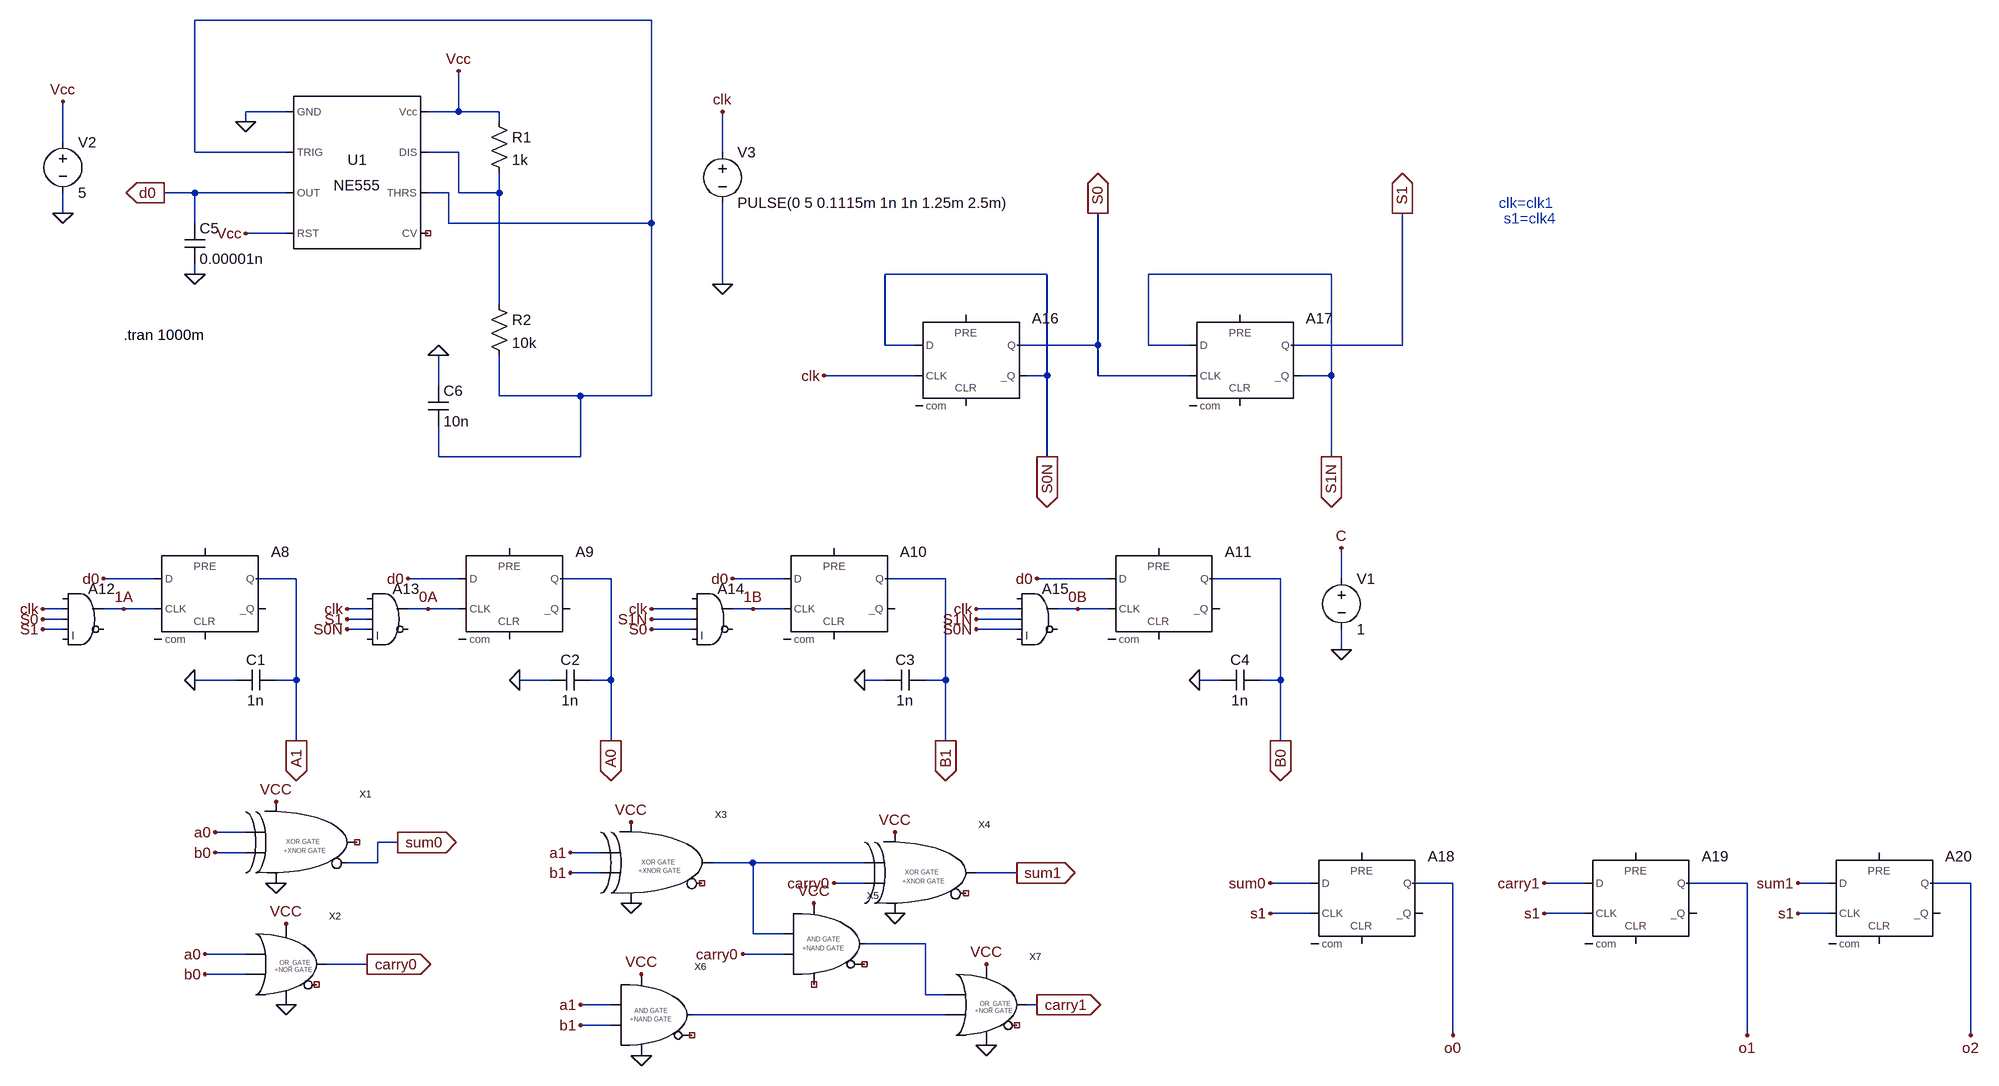
[diagram p0: schematic FAILURE.asc]
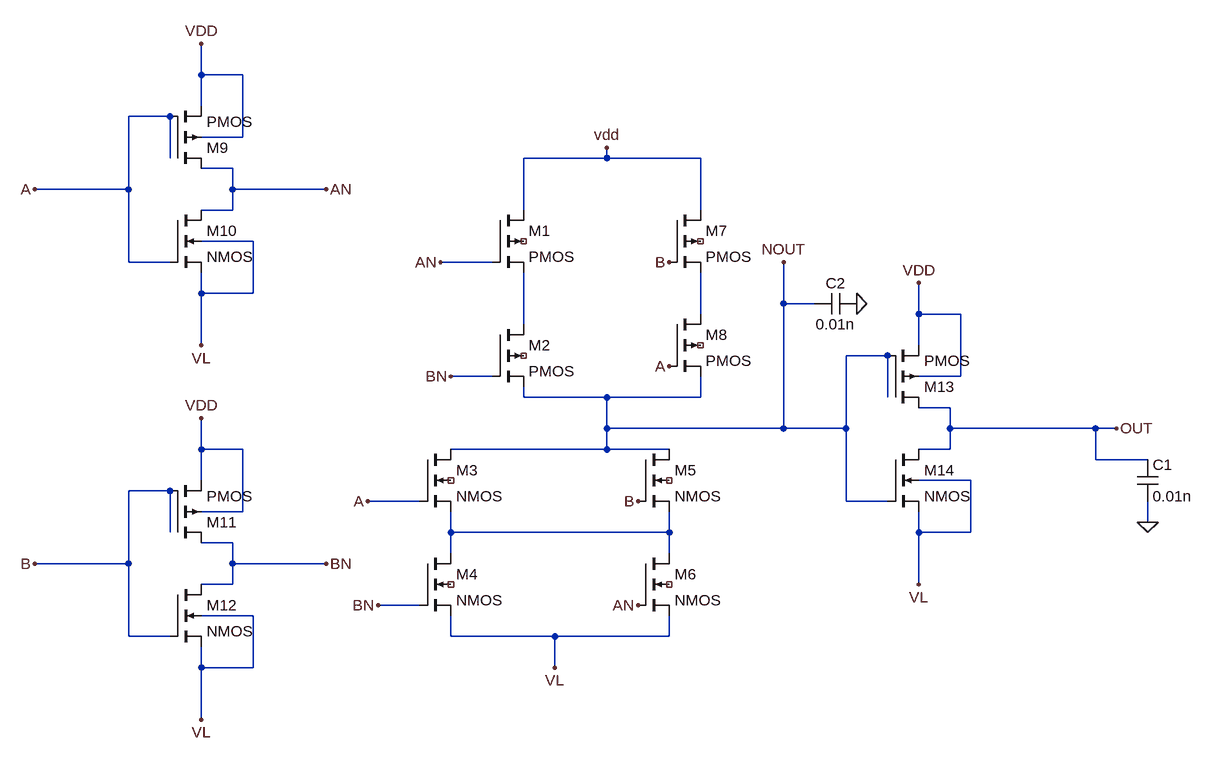
[diagram p1: sub-circuit xor_gate.asc]
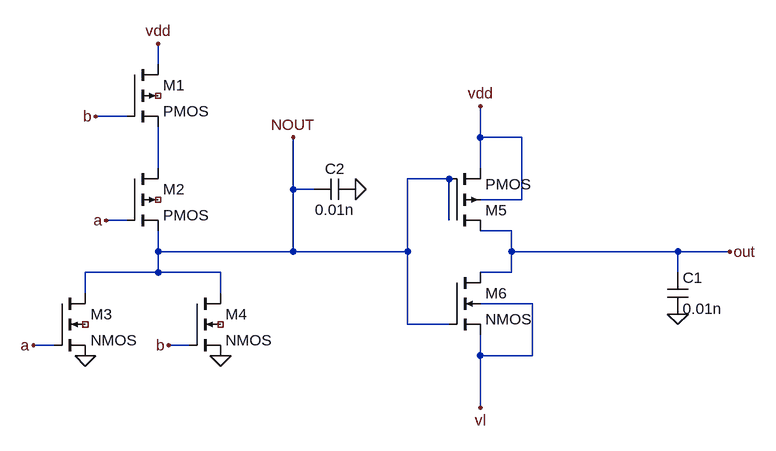
[diagram p2: sub-circuit or_gate1.asc]
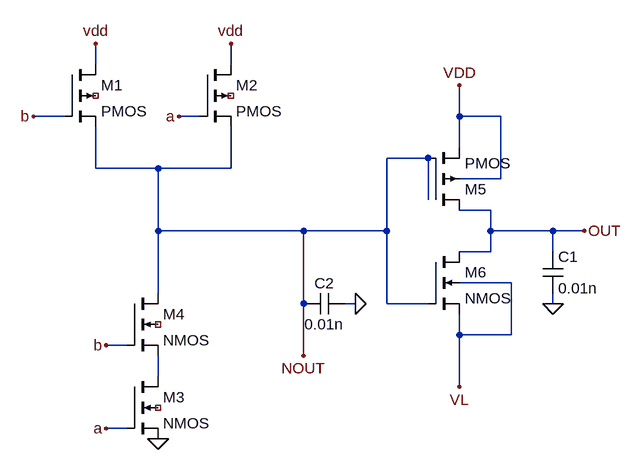
[diagram p3: sub-circuit and_gate1.asc]
FAILURE.asc, the LTspice schematic file:
Version 4
SHEET 1 1872 1100
WIRE -240 -720 -960 -720
WIRE -816 -576 -880 -576
WIRE -544 -576 -544 -640
WIRE -544 -576 -592 -576
WIRE -480 -576 -544 -576
WIRE -880 -560 -880 -576
WIRE -480 -560 -480 -576
WIRE -1168 -528 -1168 -592
WIRE -960 -512 -960 -720
WIRE -816 -512 -960 -512
WIRE -544 -512 -592 -512
WIRE -128 -512 -128 -576
WIRE -960 -448 -1008 -448
WIRE -816 -448 -960 -448
WIRE -560 -448 -592 -448
WIRE -544 -448 -544 -512
WIRE -480 -448 -480 -480
WIRE -480 -448 -544 -448
WIRE -1168 -416 -1168 -448
WIRE -960 -400 -960 -448
WIRE -560 -400 -560 -448
WIRE -240 -400 -240 -720
WIRE -240 -400 -560 -400
WIRE -816 -384 -880 -384
WIRE -960 -320 -960 -336
WIRE 384 -320 128 -320
WIRE 832 -320 544 -320
WIRE -128 -304 -128 -432
WIRE -480 -272 -480 -448
WIRE 128 -208 128 -320
WIRE 176 -208 128 -208
WIRE 464 -208 464 -416
WIRE 464 -208 336 -208
WIRE 544 -208 544 -320
WIRE 608 -208 544 -208
WIRE 944 -208 944 -416
WIRE 944 -208 768 -208
WIRE 176 -160 32 -160
WIRE 384 -160 384 -320
WIRE 384 -160 352 -160
WIRE 464 -160 464 -208
WIRE 608 -160 464 -160
WIRE 832 -160 832 -320
WIRE 832 -160 784 -160
WIRE -576 -144 -576 -192
WIRE -480 -128 -480 -192
WIRE -352 -128 -480 -128
WIRE -240 -128 -240 -400
WIRE -240 -128 -352 -128
WIRE -576 -32 -576 -80
WIRE -352 -32 -352 -128
WIRE -352 -32 -576 -32
WIRE 384 -32 384 -160
WIRE 832 -32 832 -160
WIRE -1024 160 -1104 160
WIRE -800 160 -864 160
WIRE -544 160 -624 160
WIRE -304 160 -384 160
WIRE -32 160 -112 160
WIRE 224 160 128 160
WIRE 480 160 368 160
WIRE 752 160 640 160
WIRE 848 160 848 112
WIRE -1168 208 -1200 208
WIRE -1072 208 -1104 208
WIRE -1024 208 -1072 208
WIRE -688 208 -720 208
WIRE -592 208 -624 208
WIRE -544 208 -592 208
WIRE -176 208 -240 208
WIRE -80 208 -112 208
WIRE -32 208 -80 208
WIRE 336 208 272 208
WIRE 432 208 400 208
WIRE 480 208 432 208
WIRE -1168 224 -1200 224
WIRE -688 224 -720 224
WIRE -176 224 -240 224
WIRE 336 224 272 224
WIRE -1168 240 -1200 240
WIRE -688 240 -720 240
WIRE -176 240 -240 240
WIRE 336 240 272 240
WIRE 848 272 848 240
WIRE -896 320 -960 320
WIRE -800 320 -800 160
WIRE -800 320 -832 320
WIRE -400 320 -448 320
WIRE -304 320 -304 160
WIRE -304 320 -336 320
WIRE 128 320 96 320
WIRE 224 320 224 160
WIRE 224 320 192 320
WIRE 656 320 624 320
WIRE 752 320 752 160
WIRE 752 320 720 320
WIRE -800 416 -800 320
WIRE -304 416 -304 320
WIRE 224 416 224 320
WIRE 752 416 752 320
WIRE -880 560 -928 560
WIRE -640 576 -672 576
WIRE -880 592 -928 592
WIRE -320 592 -368 592
WIRE -672 608 -672 576
WIRE -672 608 -720 608
WIRE -80 608 -144 608
WIRE 96 608 -80 608
WIRE -320 624 -368 624
WIRE 336 624 272 624
WIRE 96 640 48 640
WIRE 800 640 736 640
WIRE 1024 640 960 640
WIRE 1232 640 1168 640
WIRE 1488 640 1392 640
WIRE 1616 640 1568 640
WIRE 1840 640 1776 640
WIRE 800 688 736 688
WIRE 1232 688 1168 688
WIRE 1616 688 1568 688
WIRE -80 720 -80 608
WIRE -32 720 -80 720
WIRE 192 736 96 736
WIRE -880 752 -944 752
WIRE -32 752 -96 752
WIRE -688 768 -752 768
WIRE -880 784 -944 784
WIRE 192 816 192 736
WIRE 224 816 192 816
WIRE -304 832 -352 832
WIRE 368 832 352 832
WIRE 224 848 -176 848
WIRE -304 864 -352 864
WIRE 1024 880 1024 640
WIRE 1488 880 1488 640
WIRE 1840 880 1840 640
FLAG -368 592 a1
FLAG -368 624 b1
FLAG 48 640 carry0
FLAG 336 624 sum1
IOPIN 336 624 Out
FLAG -352 832 a1
FLAG -352 864 b1
FLAG -96 752 carry0
FLAG 368 832 carry1
IOPIN 368 832 Out
FLAG -928 560 a0
FLAG -928 592 b0
FLAG -944 752 a0
FLAG -944 784 b0
FLAG -688 768 carry0
IOPIN -688 768 Out
FLAG -640 576 sum0
IOPIN -640 576 Out
FLAG -1104 160 d0
FLAG -624 160 d0
FLAG -112 160 d0
FLAG 368 160 d0
FLAG -1200 208 clk
FLAG -720 208 clk
FLAG -240 208 clk
FLAG 272 208 clk
FLAG -1200 224 S0
FLAG -1200 240 S1
FLAG -720 224 S1
FLAG -240 240 S0
FLAG -800 416 A1
IOPIN -800 416 Out
FLAG 752 416 B0
IOPIN 752 416 Out
FLAG -720 240 S0N
FLAG -240 224 S1N
FLAG 272 224 S1N
FLAG 272 240 S0N
FLAG -304 416 A0
IOPIN -304 416 Out
FLAG 224 416 B1
IOPIN 224 416 Out
FLAG -960 320 0
FLAG -448 320 0
FLAG 96 320 0
FLAG 624 320 0
FLAG -1072 208 1A
FLAG -592 208 0A
FLAG -80 208 1B
FLAG 432 208 0B
FLAG 848 112 C
FLAG 848 272 0
FLAG 32 -160 clk
FLAG 464 -416 S0
IOPIN 464 -416 Out
FLAG 384 -32 S0N
IOPIN 384 -32 Out
FLAG 944 -416 S1
IOPIN 944 -416 Out
FLAG 832 -32 S1N
IOPIN 832 -32 Out
FLAG -880 -560 0
FLAG -544 -640 Vcc
FLAG -880 -384 Vcc
FLAG -1168 -592 Vcc
FLAG -1168 -416 0
FLAG -1008 -448 d0
IOPIN -1008 -448 Out
FLAG -960 -320 0
FLAG -128 -304 0
FLAG -128 -576 clk
FLAG -576 -192 0
FLAG 736 640 sum0
FLAG 736 688 s1
FLAG 1024 880 o0
FLAG 1488 880 o1
FLAG 1840 880 o2
FLAG 1568 640 sum1
FLAG 1568 688 s1
FLAG 1168 640 carry1
FLAG 1168 688 s1
FLAG -832 512 VCC
FLAG -816 704 VCC
FLAG -832 640 0
FLAG -816 832 0
FLAG -272 544 VCC
FLAG 144 560 VCC
FLAG 288 768 VCC
FLAG 16 672 VCC
FLAG -256 784 VCC
FLAG -272 672 0
FLAG 144 688 0
FLAG 288 896 0
FLAG -256 912 0
SYMBOL Digital\\dflop -944 112 R0
SYMATTR InstName A8
SYMBOL Digital\\dflop -464 112 R0
SYMATTR InstName A9
SYMBOL Digital\\dflop 48 112 R0
SYMATTR InstName A10
SYMBOL Digital\\dflop 560 112 R0
SYMATTR InstName A11
SYMBOL Digital\\and -1136 160 R0
SYMATTR InstName A12
SYMBOL Digital\\and -656 160 R0
SYMATTR InstName A13
SYMBOL Digital\\and -144 160 R0
SYMATTR InstName A14
SYMBOL Digital\\and 368 160 R0
SYMATTR InstName A15
SYMBOL cap -832 304 R90
WINDOW 0 0 32 VBottom 2
WINDOW 3 32 32 VTop 2
SYMATTR InstName C1
SYMATTR Value 1n
SYMBOL cap -336 304 R90
WINDOW 0 0 32 VBottom 2
WINDOW 3 32 32 VTop 2
SYMATTR InstName C2
SYMATTR Value 1n
SYMBOL cap 192 304 R90
WINDOW 0 0 32 VBottom 2
WINDOW 3 32 32 VTop 2
SYMATTR InstName C3
SYMATTR Value 1n
SYMBOL cap 720 304 R90
WINDOW 0 0 32 VBottom 2
WINDOW 3 32 32 VTop 2
SYMATTR InstName C4
SYMATTR Value 1n
SYMBOL voltage 848 144 R0
WINDOW 123 0 0 Left 0
WINDOW 39 0 0 Left 0
SYMATTR InstName V1
SYMATTR Value 1
SYMBOL Digital\\dflop 256 -256 R0
SYMATTR InstName A16
SYMBOL Digital\\dflop 688 -256 R0
SYMATTR InstName A17
SYMBOL Misc\\NE555 -704 -480 R0
SYMATTR InstName U1
SYMBOL res -496 -576 R0
SYMATTR InstName R1
SYMATTR Value 1k
SYMBOL voltage -1168 -544 R0
WINDOW 123 0 0 Left 0
WINDOW 39 0 0 Left 0
SYMATTR InstName V2
SYMATTR Value 5
SYMBOL cap -976 -400 R0
SYMATTR InstName C5
SYMATTR Value 0.00001n
SYMBOL voltage -128 -528 R0
WINDOW 123 0 0 Left 0
WINDOW 39 0 0 Left 0
SYMATTR InstName V3
SYMATTR Value PULSE(0 5 0.1115m 1n 1n 1.25m 2.5m)
SYMBOL res -496 -288 R0
SYMATTR InstName R2
SYMATTR Value 10k
SYMBOL cap -592 -144 R0
SYMATTR InstName C6
SYMATTR Value 10n
SYMBOL Digital\\dflop 880 592 R0
SYMATTR InstName A18
SYMBOL Digital\\dflop 1312 592 R0
SYMATTR InstName A19
SYMBOL Digital\\dflop 1696 592 R0
SYMATTR InstName A20
SYMBOL XOR_GATE -880 592 R0
SYMATTR InstName X1
SYMBOL or_gate1 -912 800 R0
SYMATTR InstName X2
SYMBOL XOR_GATE -320 624 R0
SYMATTR InstName X3
SYMBOL XOR_GATE 96 640 R0
SYMATTR InstName X4
SYMBOL AND_GATE1 -80 752 R0
SYMATTR InstName X5
SYMBOL AND_GATE1 -352 864 R0
SYMATTR InstName X6
SYMBOL or_gate1 192 864 R0
SYMATTR InstName X7
TEXT 1096 -432 Left 2 ;clk=clk1
TEXT 1104 -408 Left 2 ;s1=clk4
TEXT -1072 -224 Left 2 !.tran 1000m

xor_gate.asc, the sub-circuit schematic file:
Version 4
SHEET 1 1020 680
WIRE -512 -432 -512 -480
WIRE -448 -432 -512 -432
WIRE -512 -384 -512 -432
WIRE -560 -368 -624 -368
WIRE -448 -336 -448 -432
WIRE -448 -336 -512 -336
WIRE -560 -304 -560 -368
WIRE 112 -304 112 -320
WIRE 112 -304 -16 -304
WIRE 256 -304 112 -304
WIRE -464 -288 -512 -288
WIRE -624 -256 -624 -368
WIRE -624 -256 -768 -256
WIRE -464 -256 -464 -288
WIRE -320 -256 -464 -256
WIRE -464 -224 -464 -256
WIRE -464 -224 -512 -224
WIRE -16 -224 -16 -304
WIRE 256 -224 256 -304
WIRE -432 -176 -512 -176
WIRE -624 -144 -624 -256
WIRE -560 -144 -624 -144
WIRE -64 -144 -144 -144
WIRE -512 -96 -512 -128
WIRE -432 -96 -432 -176
WIRE -432 -96 -512 -96
WIRE 384 -80 384 -144
WIRE 432 -80 384 -80
WIRE 256 -64 256 -128
WIRE 592 -64 592 -112
WIRE 656 -64 592 -64
WIRE -16 -48 -16 -128
WIRE -512 -16 -512 -96
WIRE 592 -16 592 -64
WIRE 544 0 480 0
WIRE -64 32 -128 32
WIRE 656 32 656 -64
WIRE 656 32 592 32
WIRE -16 64 -16 48
WIRE 112 64 -16 64
WIRE 256 64 256 32
WIRE 256 64 112 64
WIRE 544 64 544 0
WIRE 640 80 592 80
WIRE 112 112 112 64
WIRE 384 112 384 -80
WIRE 384 112 112 112
WIRE 480 112 480 0
WIRE 480 112 384 112
WIRE 640 112 640 80
WIRE 864 112 640 112
WIRE 896 112 864 112
WIRE -512 144 -512 96
WIRE -448 144 -512 144
WIRE 112 144 112 112
WIRE 112 144 -128 144
WIRE 208 144 112 144
WIRE 640 144 640 112
WIRE 640 144 592 144
WIRE 864 160 864 112
WIRE 944 160 864 160
WIRE -512 192 -512 144
WIRE 672 192 592 192
WIRE -560 208 -624 208
WIRE -176 224 -256 224
WIRE 480 224 480 112
WIRE 544 224 480 224
WIRE -448 240 -448 144
WIRE -448 240 -512 240
WIRE 944 256 944 224
WIRE -560 272 -560 208
WIRE -128 272 -128 240
WIRE 208 272 208 240
WIRE 208 272 -128 272
WIRE 592 272 592 240
WIRE 672 272 672 192
WIRE 672 272 592 272
WIRE -464 288 -512 288
WIRE -128 304 -128 272
WIRE 208 304 208 272
WIRE -624 320 -624 208
WIRE -624 320 -768 320
WIRE -464 320 -464 288
WIRE -320 320 -464 320
WIRE -464 352 -464 320
WIRE -464 352 -512 352
WIRE 592 352 592 272
WIRE -176 384 -240 384
WIRE -432 400 -512 400
WIRE -624 432 -624 320
WIRE -560 432 -624 432
WIRE -128 432 -128 400
WIRE 32 432 -128 432
WIRE 208 432 208 400
WIRE 208 432 32 432
WIRE -512 480 -512 448
WIRE -432 480 -432 400
WIRE -432 480 -512 480
WIRE 32 480 32 432
WIRE -512 560 -512 480
FLAG -144 -144 AN
FLAG 160 224 B
FLAG -256 224 A
FLAG -128 32 BN
FLAG 112 -320 vdd
FLAG 208 -144 B
FLAG 208 16 A
FLAG -240 384 BN
FLAG 896 112 OUT
FLAG 160 384 AN
FLAG 944 256 0
FLAG -320 -256 AN
FLAG -512 -16 VL
FLAG -512 -480 VDD
FLAG -768 -256 A
FLAG -320 320 BN
FLAG -512 560 VL
FLAG -512 96 VDD
FLAG -768 320 B
FLAG 32 480 VL
FLAG 592 352 VL
FLAG 592 -112 VDD
FLAG 384 -144 NOUT
FLAG 496 -80 0
SYMBOL pmos4 -64 -224 R0
SYMATTR InstName M1
SYMBOL pmos4 -64 -48 R0
SYMATTR InstName M2
SYMBOL nmos4 -176 144 R0
SYMATTR InstName M3
SYMBOL nmos4 -176 304 R0
SYMATTR InstName M4
SYMBOL nmos4 160 144 R0
SYMATTR InstName M5
SYMBOL nmos4 160 304 R0
SYMATTR InstName M6
SYMBOL pmos4 208 -224 R0
SYMATTR InstName M7
SYMBOL pmos4 208 -64 R0
SYMATTR InstName M8
SYMBOL cap 928 160 R0
SYMATTR InstName C1
SYMATTR Value 0.01n
SYMBOL pmos4 -560 -288 M180
SYMATTR InstName M9
SYMBOL nmos4 -560 -224 R0
SYMATTR InstName M10
SYMBOL pmos4 -560 288 M180
SYMATTR InstName M11
SYMBOL nmos4 -560 352 R0
SYMATTR InstName M12
SYMBOL pmos4 544 80 M180
SYMATTR InstName M13
SYMBOL nmos4 544 144 R0
SYMATTR InstName M14
SYMBOL cap 496 -96 R90
WINDOW 0 0 32 VBottom 2
WINDOW 3 32 32 VTop 2
SYMATTR InstName C2
SYMATTR Value 0.01n

or_gate1.asc, the sub-circuit schematic file:
Version 4
SHEET 1 880 680
WIRE -144 -176 -144 -208
WIRE -192 -96 -240 -96
WIRE 352 -64 352 -112
WIRE 416 -64 352 -64
WIRE -144 -16 -144 -80
WIRE 352 -16 352 -64
WIRE 304 0 240 0
WIRE 64 16 64 -64
WIRE 96 16 64 16
WIRE 416 32 416 -64
WIRE 416 32 352 32
WIRE -192 64 -224 64
WIRE 304 64 304 0
WIRE 400 80 352 80
WIRE -144 112 -144 80
WIRE 64 112 64 16
WIRE 64 112 -144 112
WIRE 240 112 240 0
WIRE 240 112 64 112
WIRE 400 112 400 80
WIRE 656 112 400 112
WIRE 736 112 656 112
WIRE -144 144 -144 112
WIRE -144 144 -256 144
WIRE -48 144 -144 144
WIRE 400 144 400 112
WIRE 400 144 352 144
WIRE 656 144 656 112
WIRE -256 176 -256 144
WIRE -48 176 -48 144
WIRE 432 192 352 192
WIRE 240 224 240 112
WIRE 304 224 240 224
WIRE -304 256 -336 256
WIRE -96 256 -128 256
WIRE 352 272 352 240
WIRE 432 272 432 192
WIRE 432 272 352 272
WIRE 352 352 352 272
FLAG -144 -208 vdd
FLAG -240 -96 b
FLAG -224 64 a
FLAG 736 112 out
FLAG -128 256 b
FLAG -336 256 a
FLAG -48 272 0
FLAG -256 272 0
FLAG 656 208 0
FLAG 352 -112 vdd
FLAG 352 352 vl
FLAG 64 -64 NOUT
FLAG 160 16 0
SYMBOL pmos4 -192 -176 R0
SYMATTR InstName M1
SYMBOL pmos4 -192 -16 R0
SYMATTR InstName M2
SYMBOL nmos4 -304 176 R0
SYMATTR InstName M3
SYMBOL nmos4 -96 176 R0
SYMATTR InstName M4
SYMBOL cap 640 144 R0
SYMATTR InstName C1
SYMATTR Value 0.01n
SYMBOL pmos4 304 80 M180
SYMATTR InstName M5
SYMBOL nmos4 304 144 R0
SYMATTR InstName M6
SYMBOL cap 96 32 R270
WINDOW 0 32 32 VTop 2
WINDOW 3 0 32 VBottom 2
SYMATTR InstName C2
SYMATTR Value 0.01n

and_gate1.asc, the sub-circuit schematic file:
Version 4
SHEET 1 880 680
WIRE 16 -128 16 -160
WIRE 224 -128 224 -160
WIRE -32 -48 -80 -48
WIRE 176 -48 144 -48
WIRE 576 -48 576 -96
WIRE 640 -48 576 -48
WIRE 576 0 576 -48
WIRE 528 16 464 16
WIRE 16 32 16 -32
WIRE 112 32 16 32
WIRE 224 32 224 -32
WIRE 224 32 112 32
WIRE 640 48 640 -48
WIRE 640 48 576 48
WIRE 528 80 528 16
WIRE 624 96 576 96
WIRE 112 128 112 32
WIRE 336 128 112 128
WIRE 464 128 464 16
WIRE 464 128 336 128
WIRE 624 128 624 96
WIRE 720 128 624 128
WIRE 768 128 720 128
WIRE 624 160 624 128
WIRE 624 160 576 160
WIRE 720 160 720 128
WIRE 656 208 576 208
WIRE 112 224 112 128
WIRE 336 240 336 128
WIRE 416 240 400 240
WIRE 464 240 464 128
WIRE 528 240 464 240
WIRE 720 240 720 224
WIRE 576 288 576 256
WIRE 656 288 656 208
WIRE 656 288 576 288
WIRE 64 304 32 304
WIRE 336 320 336 240
WIRE 112 352 112 320
WIRE 576 368 576 288
WIRE 64 432 32 432
FLAG 16 -160 vdd
FLAG -80 -48 b
FLAG 144 -48 a
FLAG 32 304 b
FLAG 32 432 a
FLAG 112 448 0
FLAG 224 -160 vdd
FLAG 768 128 OUT
FLAG 576 -96 VDD
FLAG 720 240 0
FLAG 416 240 0
FLAG 336 320 NOUT
FLAG 576 368 VL
SYMBOL pmos4 -32 -128 R0
SYMATTR InstName M1
SYMBOL pmos4 176 -128 R0
SYMATTR InstName M2
SYMBOL nmos4 64 352 R0
SYMATTR InstName M3
SYMBOL nmos4 64 224 R0
SYMATTR InstName M4
SYMBOL pmos4 528 96 M180
SYMATTR InstName M5
SYMBOL nmos4 528 160 R0
SYMATTR InstName M6
SYMBOL cap 704 160 R0
SYMATTR InstName C1
SYMATTR Value 0.01n
SYMBOL cap 336 256 R270
WINDOW 0 32 32 VTop 2
WINDOW 3 0 32 VBottom 2
SYMATTR InstName C2
SYMATTR Value 0.01n

The netlist it stands for:
* FAILURE.asc
A8 d0 0 1A 0 0 0 a1 0 DFLOP
A9 d0 0 0A 0 0 0 a0 0 DFLOP
A10 d0 0 1B 0 0 0 b1 0 DFLOP
A11 d0 0 0B 0 0 0 b0 0 DFLOP
A12 0 clk S0 S1 0 0 1A 0 AND
A13 0 clk S1 S0N 0 0 0A 0 AND
A14 0 clk S1N S0 0 0 1B 0 AND
A15 0 clk S1N S0N 0 0 0B 0 AND
C1 a1 0 1n
C2 a0 0 1n
C3 b1 0 1n
C4 b0 0 1n
V1 C 0 1
A16 S0N 0 clk 0 0 S0N S0 0 DFLOP
A17 S1N 0 S0 0 0 S1N S1 0 DFLOP
XU1 0 N001 d0 Vcc NC_01 N001 N002 Vcc NE555  ; pins GND TRIG OUT RST CV THRS DIS Vcc
R1 Vcc N002 1k
V2 Vcc 0 5
C5 d0 0 0.00001n
V3 clk 0 PULSE(0 5 0.1115m 1n 1n 1.25m 2.5m)
R2 N002 N001 10k
C6 0 N001 10n
A18 sum0 0 S1 0 0 0 o0 0 DFLOP
A19 carry1 0 S1 0 0 0 o1 0 DFLOP
A20 sum1 0 S1 0 0 0 o2 0 DFLOP
XX1 a0 b0 Vcc 0 NC_02 sum0 xor_gate
XX2 a0 b0 Vcc 0 carry0 NC_03 or_gate1
XX3 a1 b1 Vcc 0 N003 NC_04 xor_gate
XX4 N003 carry0 Vcc 0 sum1 NC_05 xor_gate
XX5 N003 carry0 Vcc NC_06 N004 NC_07 and_gate1
XX6 a1 b1 Vcc 0 N005 NC_08 and_gate1
XX7 N004 N005 Vcc 0 carry1 NC_09 or_gate1

* block symbol definitions
.subckt xor_gate A B VDD VL OUT NOUT
M1 vdd AN N002 NC_01 PMOS
M2 N002 BN NOUT NC_02 PMOS
M3 NOUT A N003 NC_03 NMOS
M4 N003 BN VL NC_04 NMOS
M5 NOUT B N003 NC_05 NMOS
M6 N003 AN VL NC_06 NMOS
M7 vdd B N001 NC_07 PMOS
M8 N001 A NOUT NC_08 PMOS
C1 OUT 0 0.01n
M9 AN A vdd vdd PMOS
M10 AN A VL VL NMOS
M11 BN B vdd vdd PMOS
M12 BN B VL VL NMOS
M13 OUT NOUT vdd vdd PMOS
M14 OUT NOUT VL VL NMOS
C2 0 NOUT 0.01n
.ends xor_gate

.subckt or_gate1 a b vdd vl out NOUT
M1 vdd b N001 NC_01 PMOS
M2 N001 a NOUT NC_02 PMOS
M3 NOUT a 0 NC_03 NMOS
M4 NOUT b 0 NC_04 NMOS
C1 out 0 0.01n
M5 out NOUT vdd vdd PMOS
M6 out NOUT vl vl NMOS
C2 NOUT 0 0.01n
.ends or_gate1

.subckt and_gate1 A B VDD VL OUT NOUT
M1 vdd b NOUT NC_01 PMOS
M2 vdd a NOUT NC_02 PMOS
M3 N001 a 0 NC_03 NMOS
M4 NOUT b N001 NC_04 NMOS
M5 OUT NOUT vdd vdd PMOS
M6 OUT NOUT VL VL NMOS
C1 OUT 0 0.01n
C2 NOUT 0 0.01n
.ends and_gate1

.model NMOS NMOS
.model PMOS PMOS
.lib standard.mos
* clk=clk1
* s1=clk4
.tran 1000m
.lib NE555.sub
.backanno
.end